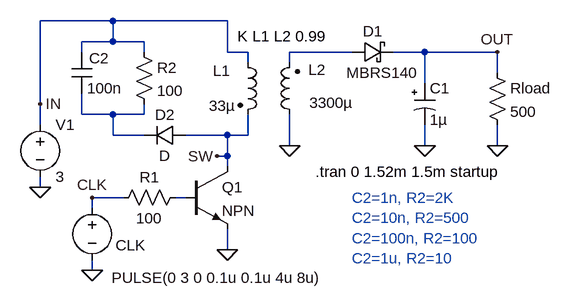
[diagram p0: schematic FlyBackDemp.asc]
FlyBackDemp.asc, the LTspice schematic file:
Version 4
SHEET 1 2376 1416
WIRE 1456 784 1344 784
WIRE 1632 784 1456 784
WIRE 1456 816 1456 784
WIRE 1456 816 1408 816
WIRE 1504 816 1456 816
WIRE 1408 832 1408 816
WIRE 1504 832 1504 816
WIRE 1632 832 1632 784
WIRE 1664 832 1632 832
WIRE 1824 832 1728 832
WIRE 1936 832 1888 832
WIRE 2048 832 1936 832
WIRE 1664 848 1664 832
WIRE 1728 848 1728 832
WIRE 2048 864 2048 832
WIRE 1936 880 1936 832
WIRE 1344 912 1344 784
WIRE 1408 928 1408 896
WIRE 1456 928 1408 928
WIRE 1504 928 1504 912
WIRE 1504 928 1456 928
WIRE 1344 944 1344 912
WIRE 1456 960 1456 928
WIRE 1504 960 1456 960
WIRE 1632 960 1568 960
WIRE 1664 960 1664 928
WIRE 1664 960 1632 960
WIRE 1728 976 1728 928
WIRE 1936 976 1936 944
WIRE 2048 976 2048 944
WIRE 1632 992 1632 960
WIRE 1632 992 1616 992
WIRE 1632 1008 1632 992
WIRE 1344 1040 1344 1024
WIRE 1472 1056 1424 1056
WIRE 1568 1056 1552 1056
WIRE 1424 1072 1424 1056
WIRE 1632 1136 1632 1104
WIRE 1424 1168 1424 1152
FLAG 2048 832 OUT
FLAG 1936 976 0
FLAG 2048 976 0
FLAG 1344 1040 0
FLAG 1632 1136 0
FLAG 1344 912 IN
FLAG 1424 1168 0
FLAG 1424 1056 CLK
FLAG 1728 976 0
FLAG 1616 992 SW
SYMBOL VOLTAGE 1344 928 R0
WINDOW 123 0 0 Left 0
SYMATTR InstName V1
SYMATTR Value 3
SYMATTR SpiceLine Rser=0.1
SYMBOL POLCAP 1920 880 R0
SYMATTR InstName C1
SYMATTR Value 1µ
SYMATTR SpiceLine Rser=0.02
SYMBOL schottky 1824 848 R270
WINDOW 0 32 32 VTop 0
WINDOW 3 0 46 VBottom 0
SYMATTR InstName D1
SYMATTR Value MBRS140
SYMBOL ind2 1648 832 R0
WINDOW 0 -38 29 Left 0
WINDOW 3 -44 83 Left 0
SYMATTR InstName L1
SYMATTR Value 33µ
SYMATTR SpiceLine Rser=0.02 Rpar=5000
SYMATTR Type ind
SYMBOL res 2032 848 R0
SYMATTR InstName Rload
SYMATTR Value 500
SYMBOL npn 1568 1008 R0
SYMATTR InstName Q1
SYMBOL res 1568 1040 R90
WINDOW 0 0 56 VBottom 0
WINDOW 3 32 56 VTop 0
SYMATTR InstName R1
SYMATTR Value 100
SYMBOL voltage 1424 1056 R0
WINDOW 0 36 73 Left 0
WINDOW 3 30 123 Left 0
WINDOW 123 0 0 Left 0
WINDOW 39 0 0 Left 0
SYMATTR InstName CLK
SYMATTR Value PULSE(0 3 0 0.1u 0.1u 4u 8u)
SYMBOL ind2 1744 944 R180
WINDOW 0 -40 85 Left 0
WINDOW 3 -82 34 Left 0
SYMATTR InstName L2
SYMATTR Value 3300µ
SYMATTR Type ind
SYMBOL cap 1392 832 R0
WINDOW 0 27 10 Left 0
SYMATTR InstName C2
SYMATTR Value 100n
SYMBOL res 1488 816 R0
SYMATTR InstName R2
SYMATTR Value 100
SYMBOL diode 1568 944 R90
WINDOW 0 0 32 VBottom 0
WINDOW 3 32 32 VTop 0
SYMATTR InstName D2
TEXT 1768 1016 Left 0 !.tran 0 1.52m 1.5m startup
TEXT 1648 808 Left 0 !K L1 L2 0.99
TEXT 1824 1056 Left 0 ;C2=1n, R2=2K\nC2=10n, R2=500\nC2=100n, R2=100\nC2=1u, R2=10

The netlist it stands for:
* FlyBackDemp.asc
V1 IN 0 3 Rser=0.1
C1 OUT 0 1µ Rser=0.02
D1 N001 OUT MBRS140
L1 IN SW 33µ Rser=0.02 Rpar=5000
Rload OUT 0 500
Q1 SW N003 0 0 NPN
R1 N003 CLK 100
V§CLK CLK 0 PULSE(0 3 0 0.1u 0.1u 4u 8u)
L2 0 N001 3300µ
C2 IN N002 100n
R2 IN N002 100
D2 SW N002 D
.model D D
.lib standard.dio
.model NPN NPN
.model PNP PNP
.lib standard.bjt
.tran 0 1.52m 1.5m startup
K L1 L2 0.99
* C2=1n, R2=2K
* C2=10n, R2=500
* C2=100n, R2=100
* C2=1u, R2=10
.backanno
.end